# Altium schematic sheet [04] LCD_PWR.SchDoc: LCD display, power supply
size A3; Engineer: M. Folejewski; DocumentNumber: 4; SheetNumber: 4; SheetTotal: 4; PageSize: A3; Designators: 1-99
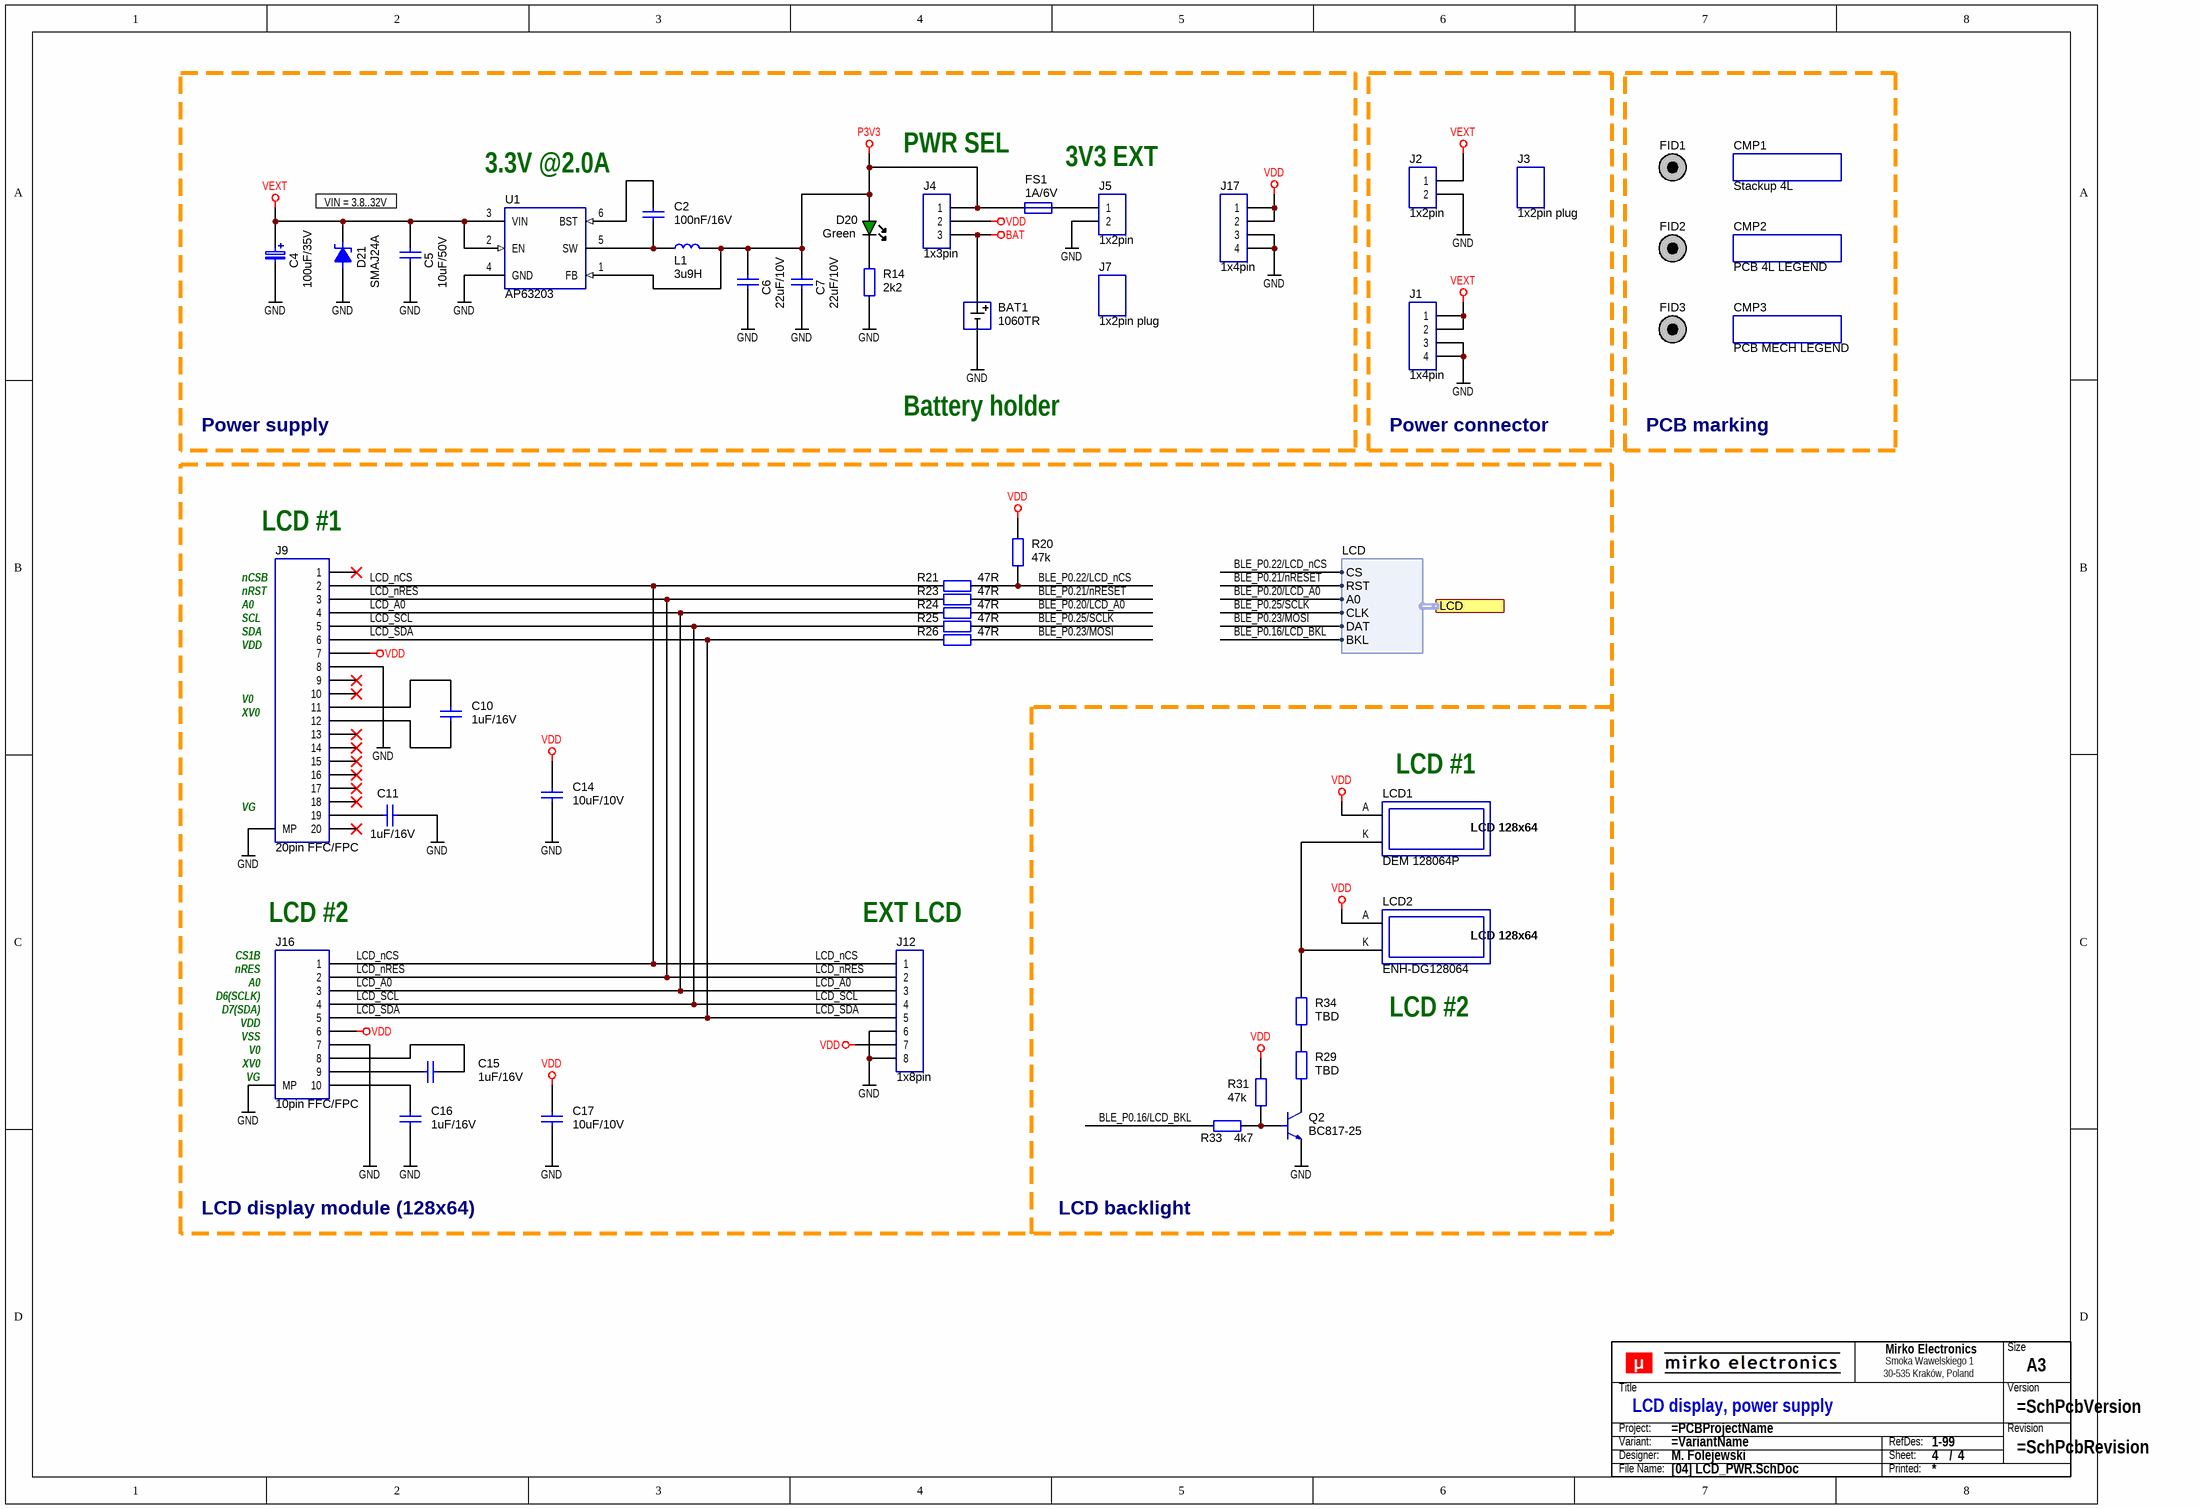
[diagram p0: [04] LCD_PWR.SchDoc]

## Parts
BAT1  1060TR  [BAT_KEY_1060]
C2  100nF/16V  [CAP_0603R]
C4  100uF/35V  [CAP_SMD_SIZE_D8]
C5  10uF/50V  [CAP_1206R]
C6  22uF/10V  [CAP_0805R]
C7  22uF/10V  [CAP_0805R]
C10  1uF/16V  [CAP_0805R]
C11  1uF/16V  [CAP_0805R]
C14  10uF/10V  [CAP_0805R]
C15  1uF/16V  [CAP_0805R]
C16  1uF/16V  [CAP_0805R]
C17  10uF/10V  [CAP_0805R]
CMP1  Stackup 4L  [PCB_STACKUP-4L]  (no BOM)
CMP2  PCB 4L LEGEND  [PCB_LAYER_LEGEND_4L]  (no BOM)
CMP3  PCB MECH LEGEND  [PCB_LAYER_LEGEND_MECH01-08_SET]  (no BOM)
D20  Green  [LED_0603R]
D21  SMAJ24A  [DIO_SMA_R]
FID1  Fiducial  [PCB_FID_RND_100x300]  (value not drawn)  (no BOM)
FID2  Fiducial  [PCB_FID_RND_100x300]  (value not drawn)  (no BOM)
FID3  Fiducial  [PCB_FID_RND_100x300]  (value not drawn)  (no BOM)
FS1  1A/6V  [FUS_ECE_SR0XX]
J1  1x4pin  [CON_HDR_P254_1X04]
J2  1x2pin  [CON_WRT_691321100002]
J3  1x2pin plug  (mechanical)
J4  1x3pin  [CON_HDR_P254_1X03]
J5  1x2pin  [CON_WRT_691321100002]
J7  1x2pin plug  (mechanical)
J9  20pin FFC/FPC  [CON_WRT_68712014522]
J12  1x8pin  [CON_HDR_P254_1X08]
J16  10pin FFC/FPC  [CON_WRT_686110183422_REV]
J17  1x4pin  [CON_HDR_P254_1X04]
L1  3u9H  [IND_BRS_SRN6028]
LCD1  DEM 128064P  [LCD_DEL_DEM128064P_FGH-PW_A2]
LCD2  ENH-DG128064  [LCD_SEE_ENH-DG128064-148-YFPTGF_A2]
Q2  BC817-25  [PKG_SOT23-3_TO236]
R14  2k2  [RES_0603R]
R20  47k  [RES_0603R]
R21  47R  [RES_0603R]
R23  47R  [RES_0603R]
R24  47R  [RES_0603R]
R25  47R  [RES_0603R]
R26  47R  [RES_0603R]
R29  TBD  [RES_0805R]
R31  47k  [RES_0603R]
R33  4k7  [RES_0603R]
R34  TBD  [RES_0805R]
TB?  Title block  (value not drawn)  (graphical)
U1  AP63203  [ICC_TSOT26]

## Ports
LCD (harness LCD)

## Harnesses
LCD: CS, RST, A0, CLK, DAT, BKL

## Nets
BAT: BAT1.2 J4.3
GND: BAT1.1 C4.1 C5.1 C6.2 C7.2 C11.2 C14.1 C16.2 C17.1 D21.2 J1.3 J1.4 J2.2 J5.2 J9.0(MP) J9.8 J12.6 J12.8 J16.0(MP) J16.7 J17.3 J17.4 Q2.2(E) R14.2 U1.4(GND)
P3V3: C6.1 C7.1 D20.2(A) FS1.1 J4.1 L1.2 U1.1(FB)
VDD: C14.2 C17.2 J4.2 J9.7 J12.7 J16.6 J17.1 J17.2 LCD1.A LCD2.A R20.2 R31.2
VEXT: C4.2 C5.2 D21.1 J1.1 J1.2 J2.1 U1.2(EN) U1.3(VIN)
BLE_P0.16/LCD_BKL: R33.2 ; port LCD.BKL
BLE_P0.20/LCD_A0: R24.1 ; port LCD.A0
BLE_P0.21/nRESET: R23.1 ; port LCD.RST
BLE_P0.22/LCD_nCS: R20.1 R21.1 ; port LCD.CS
BLE_P0.23/MOSI: R26.1 ; port LCD.DAT
BLE_P0.25/SCLK: R25.1 ; port LCD.CLK
LCD_A0: J9.4 J12.3 J16.3 R24.2
LCD_nCS: J9.2 J12.1 J16.1 R21.2
LCD_nRES: J9.3 J12.2 J16.2 R23.2
LCD_SCL: J9.5 J12.4 J16.4 R25.2
LCD_SDA: J9.6 J12.5 J16.5 R26.2
NetC2_1: C2.1 L1.1 U1.5(SW)
NetC2_2: C2.2 U1.6(BST)
NetC10_1: C10.1 J9.12
NetC10_2: C10.2 J9.11
NetC11_1: C11.1 J9.19
NetC15_1: C15.1 J16.8
NetC15_2: C15.2 J16.9
NetC16_1: C16.1 J16.10
NetD20_1: D20.1(K) R14.1
NetFS1_2: FS1.2 J5.1
NetLCD1_K: LCD1.K LCD2.K R34.2
NetQ2_1: Q2.1(B) R31.1 R33.1
NetQ2_3: Q2.3(C) R29.2
NetR29_1: R29.1 R34.1

Not connected (* = marked no-connect by the designer): J9 1* 9* 10* 13* 14* 15* 16* 17* 18* 20*

## Notes on the sheet
- 3.3V @2.0A
- PWR SEL
- 3V3 EXT
- VIN = 3.8..32V
- Power supply
- Battery holder
- Power connector
- PCB marking
- (near J9) nCSB
- (near J9) LCD #1
- (near J9) VDD
- (near J9) nRST
- (near J9) A0
- (near J9) SCL
- (near J9) SDA
- (near J9) V0
- (near J9) XV0
- (near LCD1) LCD #1
- (near J9) VG
- (near J16) CS1B
- (near J16) nRES
- (near J16) A0
- (near J16) LCD #2
- (near J12) EXT LCD
- (near J16) D6(SCLK)
- (near J16) D7(SDA)
- (near J16) VDD
- (near J16) VSS
- (near J16) V0
- (near LCD2) LCD #2
- (near J16) XV0
- (near J16) VG
- LCD display module (128x64)
- LCD backlight
- (in symbol LCD_DEL_DEM128064P_FGH-PW) LCD 128x64
- (in symbol LCD_SEE_ENH-DG128064-148-YFPTGF) LCD 128x64
- (in symbol SCH_TITLE_BLOCK_V1) Mirko Electronics; Size; Smoka Wawelskiego 1; 30-535 Kraków, Poland; Title; Version; Project:; Revision; Variant:; RefDes:; Designer:; Sheet:; /; File Name:; Printed:

## Library data of the parts
BAT1 = BAT_KEY_1060: BAT; Manufacturer: Keystone Electronics Corp.; Specification: Battery holder, CR2025/CR2032, SMD package; Component Type: Battery holder; Mounting Type: SMD; MPN: 1060TR; Operating Temperature: -xx°C to +xx°C; Package: SMD; Value: 1060TR; Replacement: ?; System: ?
C2 = CAP: Manufacturer: Yageo; MPN: CC0603KRX7R7BB104; Specification: Capacitor, 100nF, 16V, X7R, 10%, SMD 0603; Replacement: YES; Component Type: Capacitor; Mounting Type: SMD; Package: SMD 0603 (1608); Value: 100nF/16V; Operating Temperature: -55°C to +125°C; System: ?
C4 = ELCAP_SMD: ELCAP SMD; Manufacturer: Panasonic; MPN: EEEFK1V101XP; Specification: Electrolytic capacitor, 100uF, 35V, ±20%, 2000h @ 105°C, low impedance, SMD size D8 package; Replacement: YES; Component Type: Electrolytic capacitor; Mounting Type: SMD; Operating Temperature: -55°C to +105°C; Package: SMD size D8 (6.6x6.6mm); Value: 100uF/35V
C5 = CAP: Manufacturer: Taiyo Yuden; MPN: UMK316BBJ106KL-T; Specification: Capacitor, MLCC, 10uF, 50V, X5R, 10%, SMD 1206 (3216); Replacement: YES; Component Type: Capacitor; Mounting Type: SMD; Package: SMD 1206 (3216); Value: 10uF/50V; Operating Temperature: -55°C to +85°C
C6 C7 = CAP: Manufacturer: Taiyo Yuden; MPN: LMK212BBJ226MG-T; Specification: Capacitor, MLCC, 22uF, 10V, X5R, 20%, SMD 0805 (2012); Replacement: YES; Component Type: Capacitor; Mounting Type: SMD; Package: SMD 0805 (2012); Value: 22uF/10V; Operating Temperature: -55°C to +85°C; System: ?
C10 C11 C15 C16 = CAP: Manufacturer: Taiyo Yuden; MPN: EMK212B7105MG-T; Specification: Capacitor, MLCC, 1uF, 16V, X7R, 20%, SMD 0805 (2012); Replacement: YES; Component Type: Capacitor; Mounting Type: SMD; Package: SMD 0805 (2012); Value: 1uF/16V; Operating Temperature: -55°C to +125°C; System: ?
C14 C17 = CAP: Manufacturer: Murata Electronics; MPN: GRM21BR71A106KA73K; Specification: Capacitor, MLCC, 10uF, 10V, X7R, 10%, SMD 0805 (2012); Replacement: YES; Component Type: Capacitor; Mounting Type: SMD; Package: SMD 0805 (2012); Value: 10uF/10V; Operating Temperature: -55°C to +125°C
CMP1 = NonComponent: Specification: Stackup legend indicator, 8layer PCB; Component Type: Graphical; FT Item: -; Manufacturer: -; Mounting Type: Non component; MPN: -; Package: -; Value: Stackup 4L; Operating Temperature: -; Replacement: N/A
CMP2 = NonComponent: Specification: 4-Layer PCB legend information table; Component Type: Graphical; FT Item: -; Manufacturer: -; Mounting Type: Non component; MPN: -; Package: -; Value: PCB 4L LEGEND; Operating Temperature: -; Replacement: N/A
CMP3 = NonComponent: Specification: Legend information table for PCB Mechanical layers; Component Type: Graphical; FT Item: -; Manufacturer: -; Mounting Type: Non component; MPN: -; Package: -; Value: PCB MECH LEGEND; Operating Temperature: -; Replacement: N/A
D20 = LED_WRT_150060VS55040: LED; Manufacturer: Wurth Elektronik; Replacement: YES; Specification: LED diode, green, 575nm, 60mcd, 140deg, 0603 package; Component Type: LED Diode; Mounting Type: SMD; MPN: 150060VS55040; Operating Temperature: -40°C to +85°C; Package: SMD 0603 (1608); System: ?; Value: Green
D21 = DIO_DDS_SMAJ24A-13-F: Diode; Manufacturer: Diodes Incorporated; Specification: TVS Diode, unidirectional, 24V, 400W, DO-214AC (SMA) package; Replacement: YES; Component Type: TVS Diode; Mounting Type: SMD; MPN: SMAJ24A-13-F; Operating Temperature: -55°C to +150°C; Package: DO-214AC (SMA); Value: SMAJ24A; System: ?
FID1-FID3 = Fiducial: Specification: Fiducial, round, 1.5x3.0mm; Component Type: Fiducial; FT Item: -; Manufacturer: -; Mounting Type: Non component; MPN: -; Package: -; Value: Fiducial; Operating Temperature: -; Replacement: N/A
FS1 = FUS_ECE_SR0XX: Fuse; Manufacturer: Bel Fuse; MPN: 0ZCK0100FF2E; Specification: Polymer fuse, 1A, 6V, SMD 0805 (2012) package; Replacement: YES; Component Type: Polymer fuse; Mounting Type: SMD; Operating Temperature: -40°C to +85°C; Package: SMD 0805 (2012); Value: 1A/6V; System: ?
J1 J17 = CON_HDR_WRT_61300411121: CON; Manufacturer: Wurth Elektronik GmbH; Specification: Connector, pin header, 1x4 pin, single row, 2.54 pitch, straight pin, THT package; Replacement: YES; Component Type: Connector; Mounting Type: THT; MPN: 61300411121; Operating Temperature: -40°C to +125°C; Package: THT; Value: 1x4pin; System: ?
J2 J5 = CON_HDR_WRT_691321100002: Connector; Manufacturer: Wurth Elektronik GmbH; Specification: Connector, terminal block, 1x2 pin, 3.50 pitch, vertical, THT package; Replacement: YES; Component Type: Connector; Mounting Type: THT; MPN: 691321100002; Operating Temperature: -40°C to +105°C; Package: THT; Value: 1x2pin; System: ?
J3 J7 = CON_HDR_WRT_691363110002: Connector; Manufacturer: Wurth Elektronik GmbH; Specification: Connector, terminal block plug, 1x2 pin, 3.50 pitch, vertical, THT package; Replacement: YES; Component Type: Connector; Mounting Type: THT; MPN: 691363110002; Operating Temperature: -40°C to +105°C; Package: THT; Value: 1x2pin plug; System: ?
J4 = CON_HDR_WRT_61300311121: Connector; Manufacturer: Wurth Elektronik GmbH; Specification: Connector, pin header, 1x3 pin, single row, 2.54 pitch, straight pin, THT package; Replacement: YES; Component Type: Connector; Mounting Type: THT; MPN: 61300311121; Operating Temperature: -40°C to +125°C; Package: THT; Value: 1x3pin; System: ?
J9 = CON_WRT_68712014522: Connector; Manufacturer: Wurth Elektronik GmbH; Specification: WR-FPC SMT ZIF Horizontal, bottom contact, 0.50 mm pitch, 20pin, SMD package; Replacement: YES; Component Type: Connector; Mounting Type: SMD; MPN: 68712014522; Operating Temperature: -25°C to +85°C; Package: SMD FFC/FPC; Value: 20pin FFC/FPC; System: ?
J12 = CON_HDR_1X08: Connector, 8pin; Manufacturer: Wurth Elektronik GmbH; MPN: 61300811121; Specification: Connector, pin header, 1x8 pin, single row, 2.54 pitch, straight pin, THT package; Replacement: YES; Component Type: Connector; Mounting Type: THT; Operating Temperature: -40°C to +125°C; Package: THT; Value: 1x8pin; System: ?
J16 = CON_WRT_686110183422: Connector; Manufacturer: Wurth Elektronik GmbH; Specification: WR-FPC SMT ZIF Horizontal, top contacts, 1.00 mm pitch, 10 pin, SMD package; Replacement: YES; Component Type: Connector; Mounting Type: SMD; MPN: 686110183422; Operating Temperature: -25°C to +85°C; Package: SMD FFC/FPC; Value: 10pin FFC/FPC; System: ?
L1 = IND: Manufacturer: Bourns; MPN: SRN6028-3R9M; Specification: Semi-shielded power inductor, 3.9uH, Isat 2.7A, DCR 38mOhm, SRN6028 series, SMD 6.0x6.0x2.8mm package; Replacement: YES; Component Type: Inductor; Mounting Type: SMD; Operating Temperature: -40°C to +125°C; Package: SMD 6.0x6.0x2.8mm; Value: 3u9H
LCD1 = LCD_DEL_DEM128064P_FGH-PW: LCD display; Manufacturer: Display Elektronik; MPN: DEM 128064P FGH-PW; Replacement: NO; Specification: Graphic LCD display, 128x64 pix., FSTN positive, white backlight, 37x30.3x7.1mm, ST7567 controller, THT package; Component Type: LCD display; Mounting Type: THT; Operating Temperature: -20°C to +70°C; Package: THT, 37x30.3mm; System: ?; Value: DEM 128064P
LCD2 = LCD_SEE_ENH-DG128064-148-YFPTGF: LCD display; Manufacturer: Shenzhen Enrich Electronics; Replacement: NO; Specification: Graphic LCD display, 128x64 pix., FSTN negative, white backlight, 56.60x38.60x5.10mm, ST7567 controller, THT package; Component Type: LCD display; Mounting Type: THT; MPN: ENH-DG128064-148-YFPTGF; Operating Temperature: -20°C to +70°C; Package: THT, 56.6x38.6mm; System: ?; Value: ENH-DG128064
Q2 = NPN_Transistor: NPN Transistor; Manufacturer: Nexperia (NXP); MPN: BC817-25,215; Specification: Bipolar transistor, NPN, 45V, 500mA; Replacement: YES; Component Type: Transistor; Mounting Type: SMD; Package: SOT23-3; Value: BC817-25; Operating Temperature: -65°C to +150°C
R14 = RES: Manufacturer: Yageo; MPN: RC0603FR-072K2L; Specification: Resistor, 2.2k, 1%, SMD 0603; Replacement: YES; Component Type: Resistor; Mounting Type: SMD; Package: SMD 0603 (1608); Value: 2k2; Operating Temperature: -55°C to +155°C
R20 R31 = RES: Manufacturer: Yageo; MPN: RC0603FR-0747KL; Specification: Resistor, 47k, 1%, SMD 0603; Replacement: YES; Component Type: Resistor; Mounting Type: SMD; Package: SMD 0603 (1608); Value: 47k; Operating Temperature: -55°C to +155°C; System: ?
R21 R23-R26 = RES: Manufacturer: Yageo; MPN: RC0603FR-0747RL; Specification: Resistor, 47R, 1%, SMD 0603 (1608); Replacement: YES; Component Type: Resistor; Mounting Type: SMD; Package: SMD 0603 (1608); Value: 47R; Operating Temperature: -55°C to +155°C
R29 R34 = RES: Manufacturer: Yageo; Specification: Resistor, TBD, 1%, SMD 0805 (2012); Replacement: YES; Component Type: Resistor; Mounting Type: SMD; MPN: TBD; Package: SMD 0805 (2012); Value: TBD; Operating Temperature: -55°C to +155°C
R33 = RES: Manufacturer: Yageo; MPN: RC0603FR-074K7L; Specification: Resistor, 4.7k, 1%, SMD 0603; Replacement: YES; Component Type: Resistor; Mounting Type: SMD; Package: SMD 0603 (1608); Value: 4k7; Operating Temperature: -55°C to +155°C; System: ?
TB? = SCH_TITLE_BLOCK_V1: Component Type: Title block; Manufacturer: -; Mounting Type: Non component; MPN: -; Operating Temperature: -; Package: -; Specification: Title block; Value: Title block; Replacement: -; System: ?
U1 = ICC_DDS_AP63203WU-7: ICC; Manufacturer: Diodes Incorporated; Specification: Synchronous buck converter with enhanced EMI reduction, VOUT 3.3V, VIN 3.8V - 32V, 2A, 1.1MHz, TSOT26 package; Component Type: IC; Mounting Type: SMD; MPN: AP63203WU-7; Operating Temperature: -40°C to +85°C; Package: TSOT26; Value: AP63203; Replacement: ?; System: ?